# EAGLE schematic shift_register board (EAGLE 6.4)
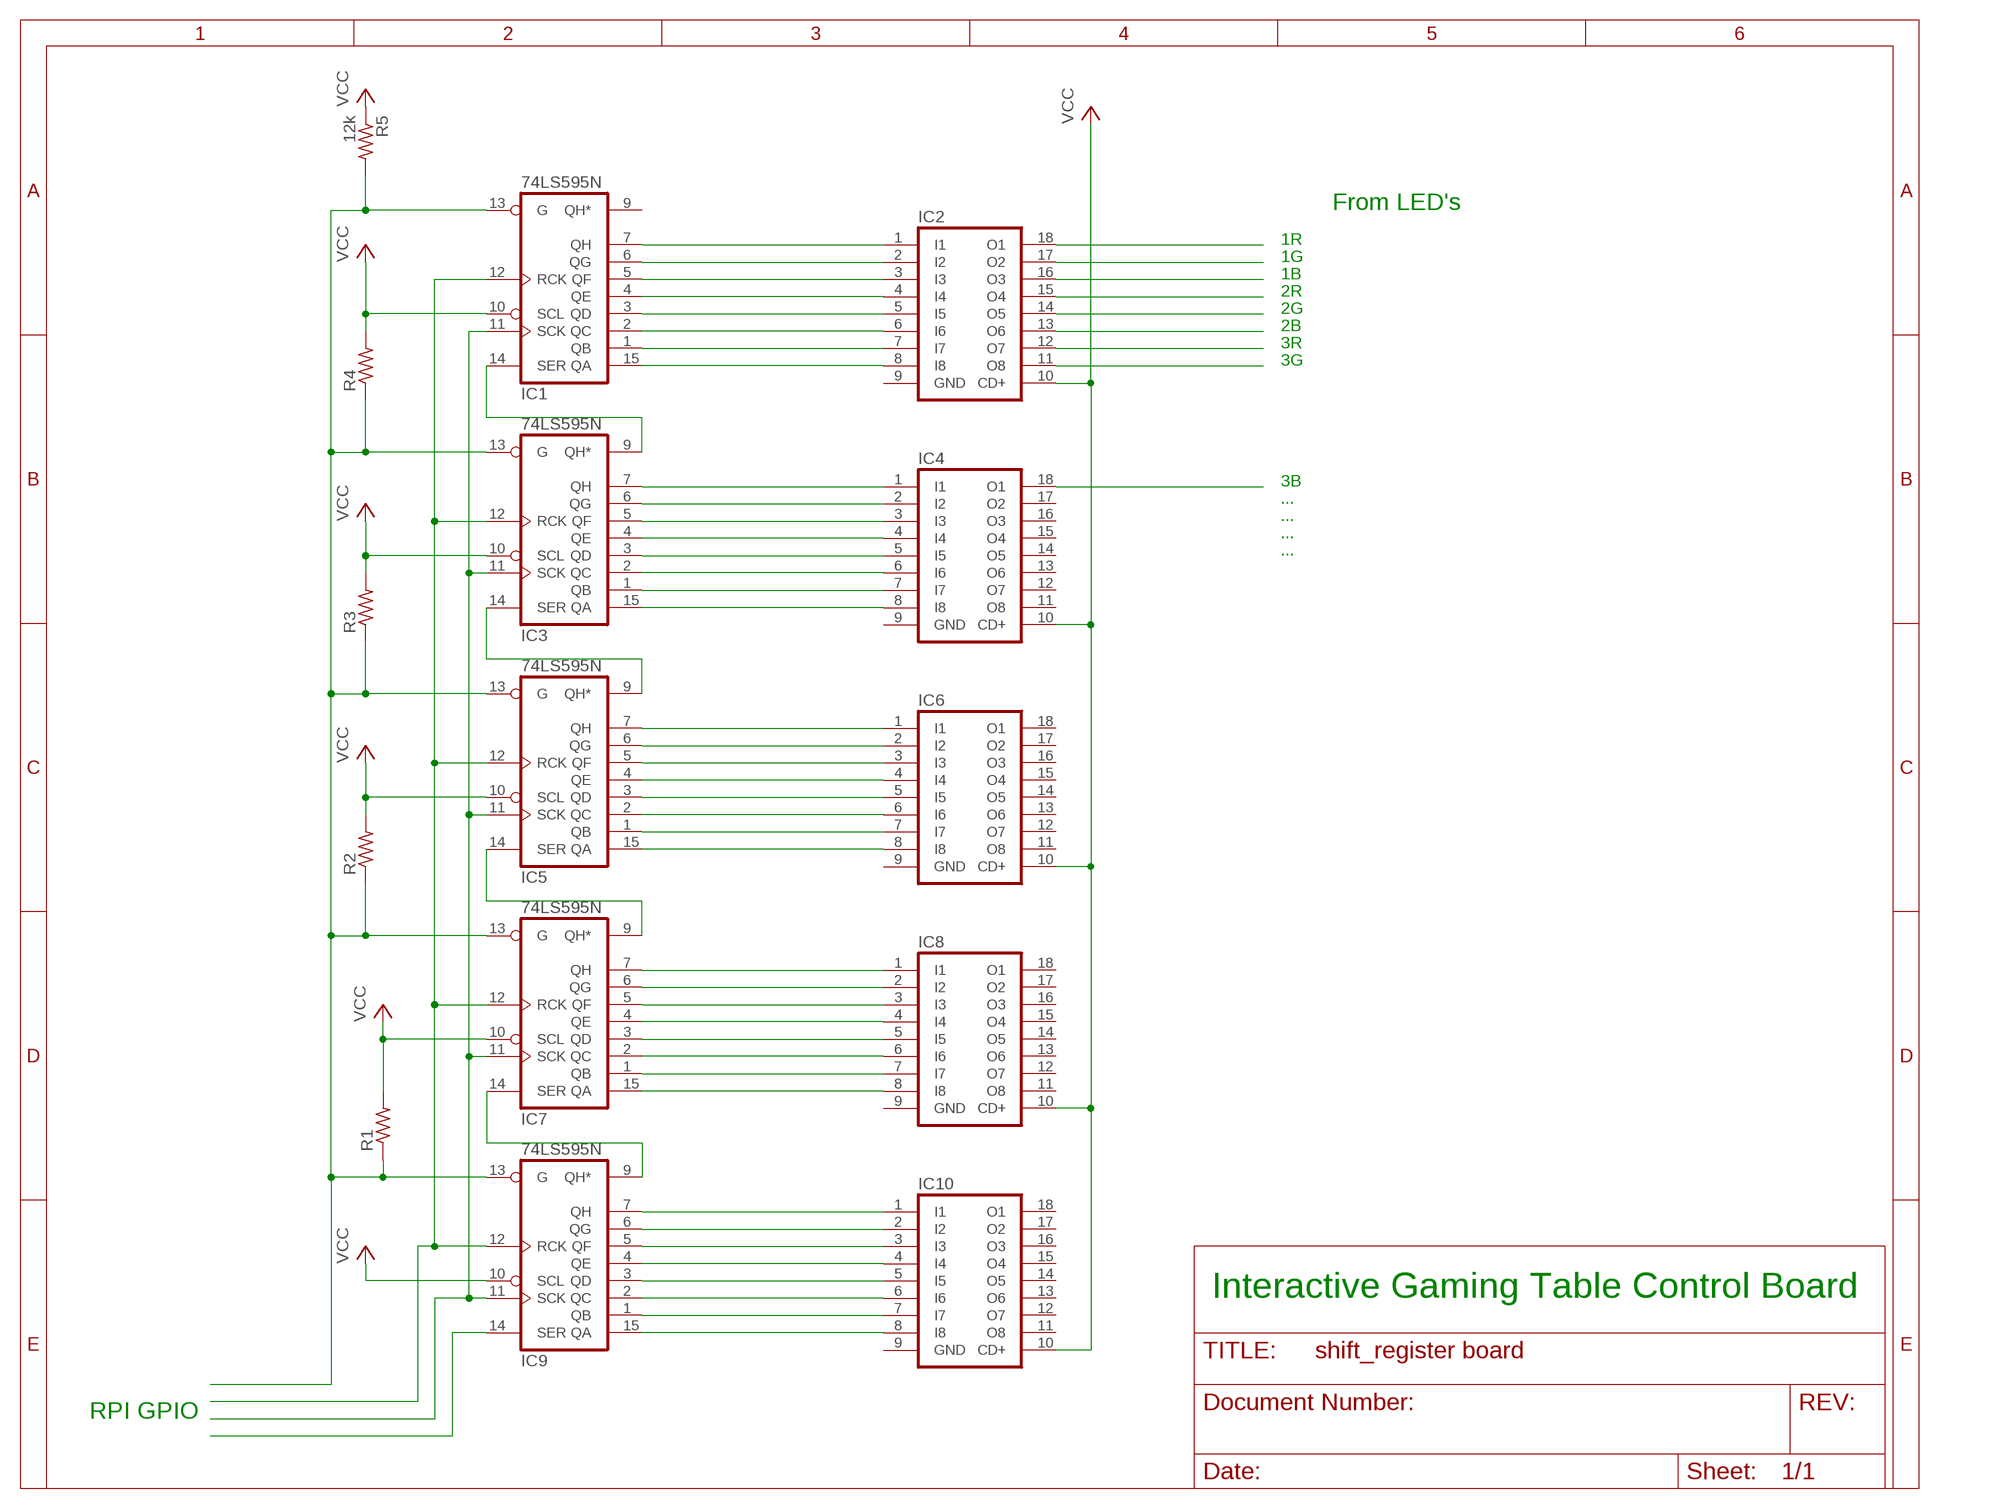
[diagram p0: schematic, sheet 1]

## Parts
IC1  74LS595N  [DIL16]
IC2  ULN2803A  [DIL18]
IC3  74LS595N  [DIL16]
IC4  ULN2803A  [DIL18]
IC5  74LS595N  [DIL16]
IC6  ULN2803A  [DIL18]
IC7  74LS595N  [DIL16]
IC8  ULN2803A  [DIL18]
IC9  74LS595N  [DIL16]
IC10  ULN2803A  [DIL18]
R1  R-US_0207/10  [0207/10]
R2  R-US_0207/10  [0207/10]
R3  R-US_0207/10  [0207/10]
R4  R-US_0207/10  [0207/10]
R5  12k  R-US_0207/10  [0207/10]

## Nets
N$1: IC1.7(QH) IC2.1(I1)
N$2: IC1.6(QG) IC2.2(I2)
N$3: IC1.5(QF) IC2.3(I3)
N$4: IC1.4(QE) IC2.4(I4)
N$5: IC1.3(QD) IC2.5(I5)
N$6: IC1.2(QC) IC2.6(I6)
N$7: IC1.1(QB) IC2.7(I7)
N$8: IC1.15(QA) IC2.8(I8)
N$9: IC3.7(QH) IC4.1(I1)
N$10: IC3.6(QG) IC4.2(I2)
N$11: IC3.5(QF) IC4.3(I3)
N$12: IC3.4(QE) IC4.4(I4)
N$13: IC3.3(QD) IC4.5(I5)
N$14: IC3.2(QC) IC4.6(I6)
N$15: IC3.1(QB) IC4.7(I7)
N$16: IC3.15(QA) IC4.8(I8)
N$17: IC5.7(QH) IC6.1(I1)
N$18: IC5.6(QG) IC6.2(I2)
N$19: IC5.5(QF) IC6.3(I3)
N$20: IC5.4(QE) IC6.4(I4)
N$21: IC5.3(QD) IC6.5(I5)
N$22: IC5.2(QC) IC6.6(I6)
N$23: IC5.1(QB) IC6.7(I7)
N$24: IC5.15(QA) IC6.8(I8)
N$25: IC7.7(QH) IC8.1(I1)
N$26: IC7.6(QG) IC8.2(I2)
N$27: IC7.5(QF) IC8.3(I3)
N$28: IC7.4(QE) IC8.4(I4)
N$29: IC7.3(QD) IC8.5(I5)
N$30: IC7.2(QC) IC8.6(I6)
N$31: IC7.1(QB) IC8.7(I7)
N$32: IC7.15(QA) IC8.8(I8)
N$33: IC9.7(QH) IC10.1(I1)
N$34: IC9.6(QG) IC10.2(I2)
N$35: IC9.5(QF) IC10.3(I3)
N$36: IC9.4(QE) IC10.4(I4)
N$37: IC9.3(QD) IC10.5(I5)
N$38: IC9.2(QC) IC10.6(I6)
N$39: IC9.1(QB) IC10.7(I7)
N$40: IC9.15(QA) IC10.8(I8)
N$41: IC9.14(SER)
N$42: IC1.11(SCK) IC3.11(SCK) IC5.11(SCK) IC7.11(SCK) IC9.11(SCK)
N$43: IC1.13(G) IC3.13(G) IC5.13(G) IC7.13(G) IC9.13(G) R1.1 R2.1 R3.1 R4.1 R5.2
N$44: IC1.12(RCK) IC3.12(RCK) IC5.12(RCK) IC7.12(RCK) IC9.12(RCK)
N$45: IC2.18(O1)
N$46: IC7.14(SER) IC9.9(QH*)
N$47: IC5.14(SER) IC7.9(QH*)
N$48: IC3.14(SER) IC5.9(QH*)
N$49: IC1.14(SER) IC3.9(QH*)
N$50: IC2.17(O2)
N$51: IC2.16(O3)
N$52: IC2.15(O4)
N$53: IC2.14(O5)
N$54: IC2.13(O6)
N$55: IC2.12(O7)
N$56: IC2.11(O8)
N$57: IC4.18(O1)
VCC: IC1.10(SCL) IC2.10(CD+) IC3.10(SCL) IC4.10(CD+) IC5.10(SCL) IC6.10(CD+) IC7.10(SCL) IC8.10(CD+) IC9.10(SCL) IC10.10(CD+) R1.2 R2.2 R3.2 R4.2 R5.1
Unconnected: IC1.9(QH*) IC4.11(O8) IC4.12(O7) IC4.13(O6) IC4.14(O5) IC4.15(O4) IC4.16(O3) IC4.17(O2) IC6.11(O8) IC6.12(O7) IC6.13(O6) IC6.14(O5) IC6.15(O4) IC6.16(O3) IC6.17(O2) IC6.18(O1) IC8.11(O8) IC8.12(O7) IC8.13(O6) IC8.14(O5) IC8.15(O4) IC8.16(O3) IC8.17(O2) IC8.18(O1) IC10.11(O8) IC10.12(O7) IC10.13(O6) IC10.14(O5) IC10.15(O4) IC10.16(O3) IC10.17(O2) IC10.18(O1)

## Notes on the sheet
- From LED's
- 1R
- 1G
- 1B
- 2R
- 2G
- 2B
- 3R
- 3G
- 3B
- ...
- ...
- ...
- ...
- Interactive Gaming Table Control Board
- RPI GPIO

## Power pins joined to a net without a drawn wire
GND: IC1.8(GND) IC2.9(GND) IC3.8(GND) IC4.9(GND) IC5.8(GND) IC6.9(GND) IC7.8(GND) IC8.9(GND) IC9.8(GND) IC10.9(GND)
VCC: IC1.16(VCC) IC3.16(VCC) IC5.16(VCC) IC7.16(VCC) IC9.16(VCC)

## Library data of the parts
IC1 IC3 IC5 IC7 IC9 = 74xx-us:74*595: 8-bit SHIFT REGISTER, output latch
IC2 IC4 IC6 IC8 IC10 = uln-udn:ULN2803A: DRIVER ARRAY
R1-R5 = resistor:R-US_: RESISTOR, American symbol